# EAGLE design atkstepper17 (EAGLE 9.0.0)
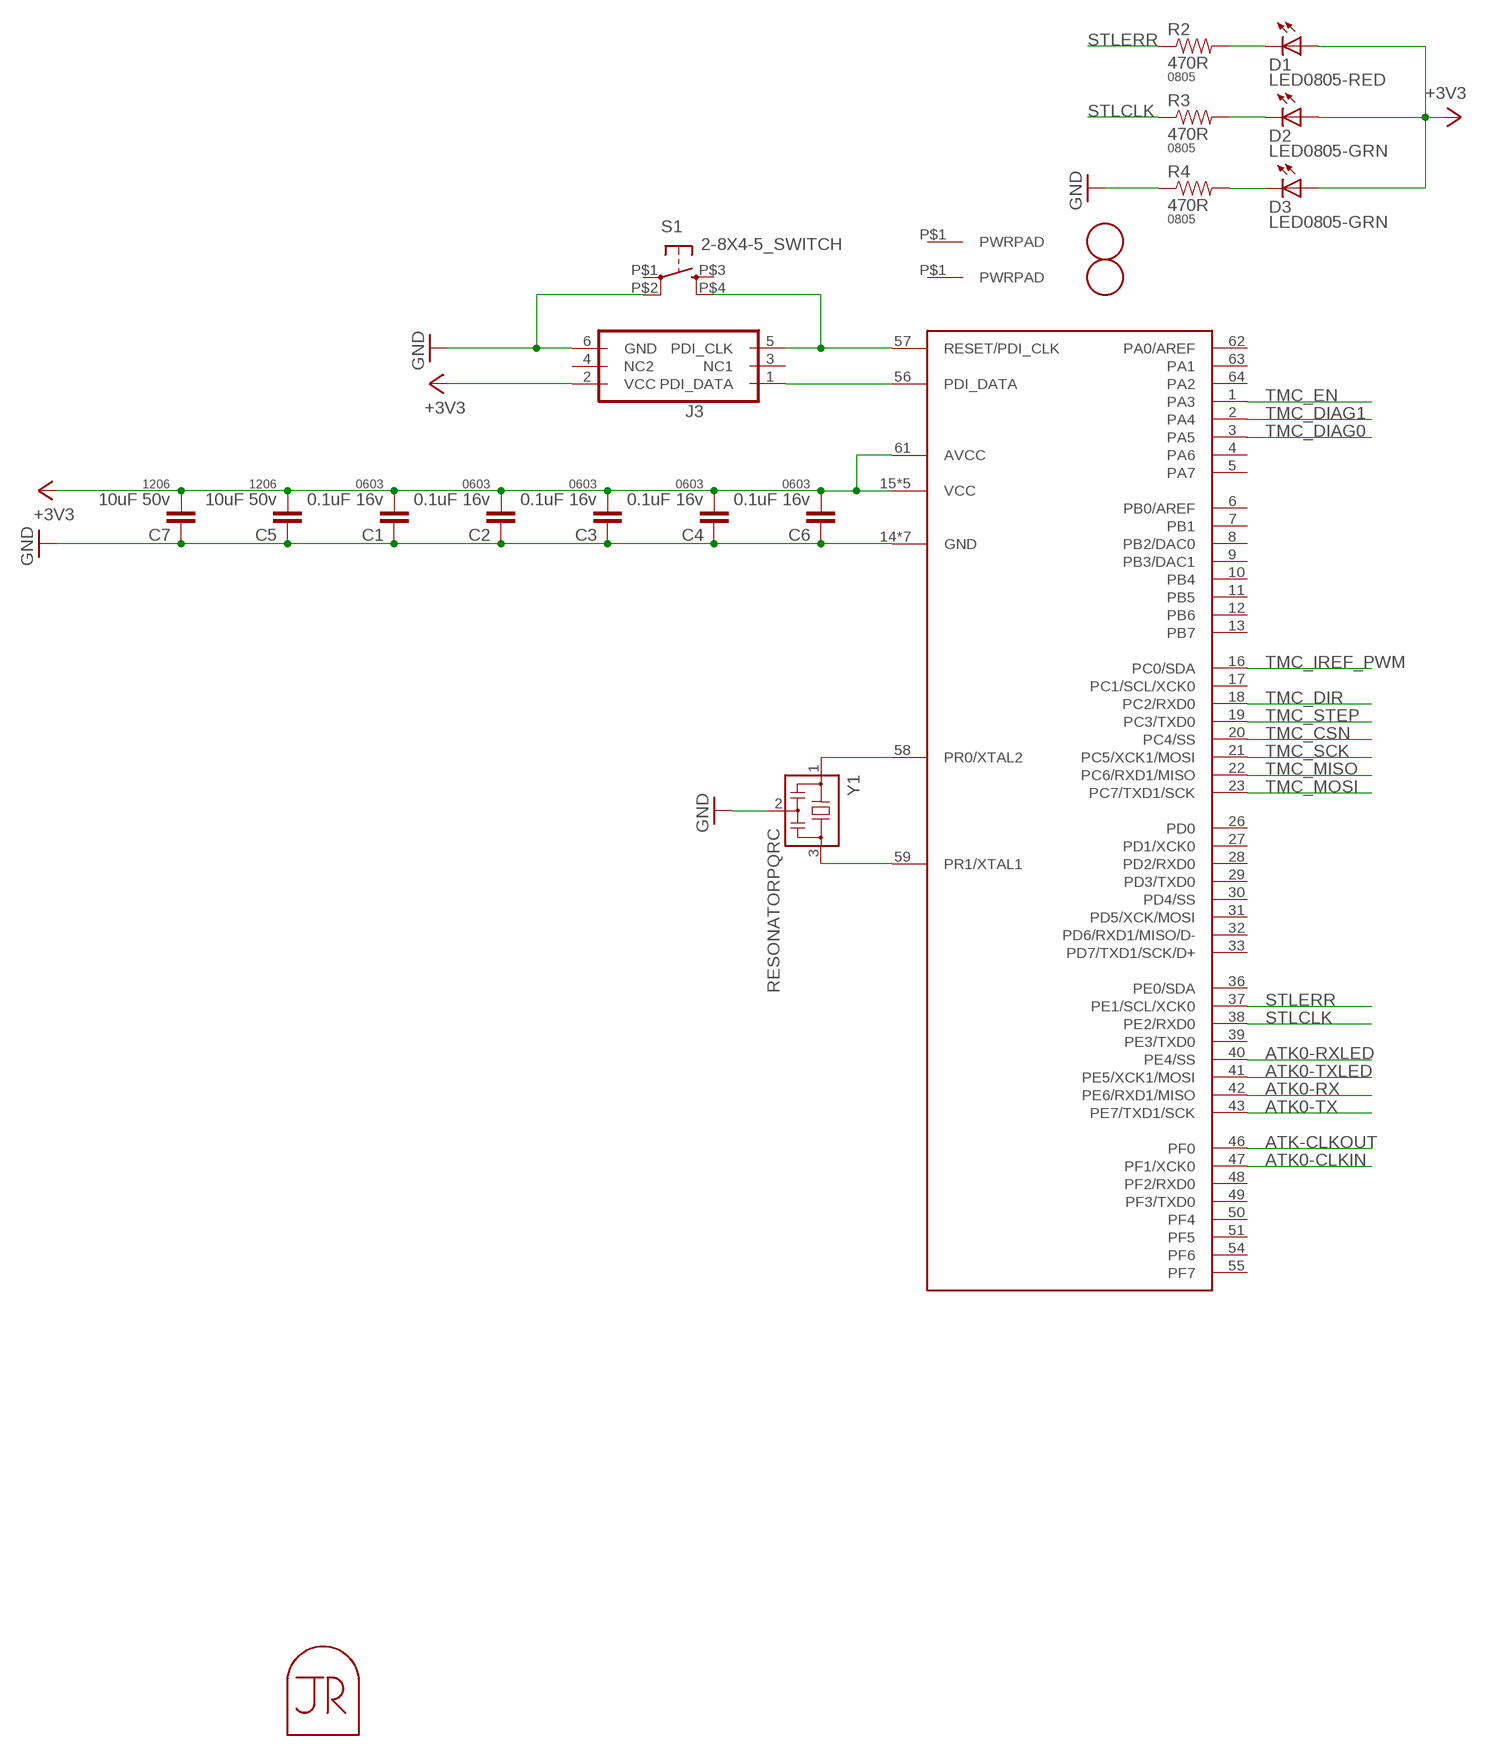
[diagram p0: schematic, sheet 1, part 1 of 2]
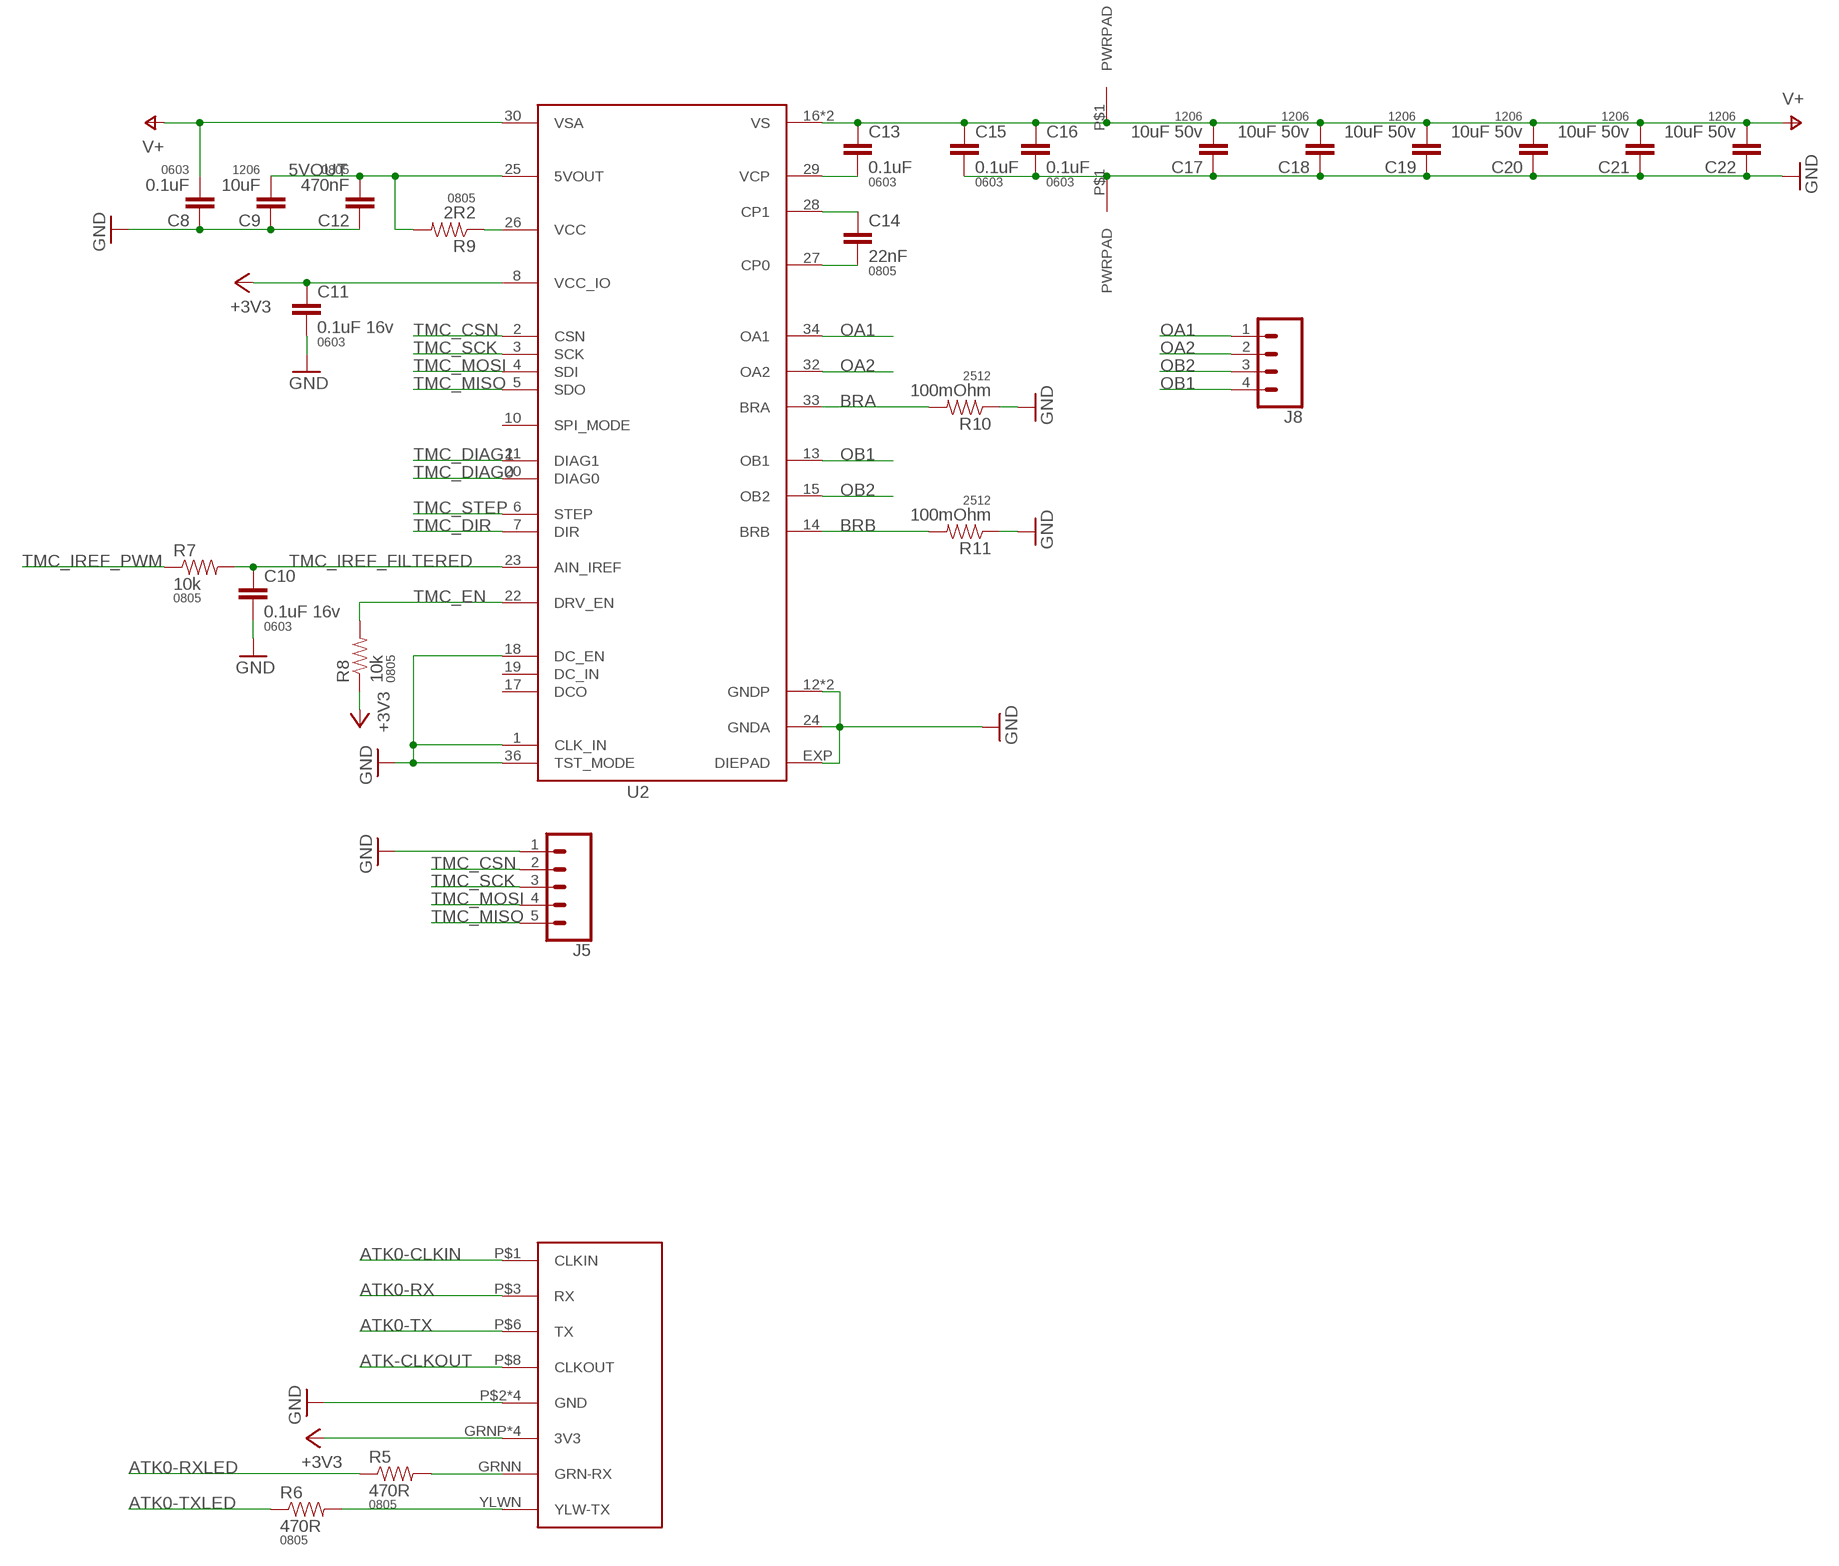
[diagram p1: schematic, sheet 1, part 2 of 2]

## Parts
C1  0.1uF 16v  CAP0603-CAP  [0603-CAP]
C2  0.1uF 16v  CAP0603-CAP  [0603-CAP]
C3  0.1uF 16v  CAP0603-CAP  [0603-CAP]
C4  0.1uF 16v  CAP0603-CAP  [0603-CAP]
C5  10uF 50v  CAP1206  [1206]
C6  0.1uF 16v  CAP0603-CAP  [0603-CAP]
C7  10uF 50v  CAP1206  [1206]
C8  0.1uF  CAP0603-CAP  [0603-CAP]
C9  10uF  CAP1206  [1206]
C10  0.1uF 16v  CAP0603-CAP  [0603-CAP]
C11  0.1uF 16v  CAP0603-CAP  [0603-CAP]
C12  470nF  CAP0805  [0805]
C13  0.1uF  CAP0603-CAP  [0603-CAP]
C14  22nF  CAP0805  [0805]
C15  0.1uF  CAP0603-CAP  [0603-CAP]
C16  0.1uF  CAP0603-CAP  [0603-CAP]
C17  10uF 50v  CAP1206  [1206]
C18  10uF 50v  CAP1206  [1206]
C19  10uF 50v  CAP1206  [1206]
C20  10uF 50v  CAP1206  [1206]
C21  10uF 50v  CAP1206  [1206]
C22  10uF 50v  CAP1206  [1206]
D1  LED0805-RED  LED0805  [LED0805]
D2  LED0805-GRN  LED0805  [LED0805]
D3  LED0805-GRN  LED0805  [LED0805]
J1  PWRPADM3  [PWRPAD_3-25MM]
J2  PWRPADM3  [PWRPAD_3-25MM]
J3  PDIFEMALE_SMD  [PDI_2X3_SMD]
J4  ATK-PHY  [RJ45-LED-RJE7318800XXX]
J5  CONN_05NO_SILK  [1X05_NO_SILK]
J6  PWRPAD  [PWRPAD_M3-PEM-MOUNT]
J7  PWRPAD  [PWRPAD_M3-PEM-MOUNT]
J8  CONN_04LONGPADS  [1X04_LONGPADS]
MP1  JRTOMBSTONE  [JRTOMBSTONE]
R2  470R  RESISTOR0805-RES  [0805]
R3  470R  RESISTOR0805-RES  [0805]
R4  470R  RESISTOR0805-RES  [0805]
R5  470R  RESISTOR0805-RES  [0805]
R6  470R  RESISTOR0805-RES  [0805]
R7  10k  RESISTOR0805-RES  [0805]
R8  10k  RESISTOR0805-RES  [0805]
R9  2R2  RESISTOR0805-RES  [0805]
R10  100mOhm  RESISTOR2512  [R2512]
R11  100mOhm  RESISTOR2512  [R2512]
S1  2-8X4-5_SWITCH  [TACT-SWITCH-KMR6]
U1  ATXMEGA_A3UQFN  [QFN-64-9X9MM]
U2  TMC2130  [QFN36-5X6]
U$1  FIDUCIAL  [FIDUCIAL_1MM]
U$2  FIDUCIAL  [FIDUCIAL_1MM]
Y1  RESONATORPQRC  [RES_PRQC]

## Nets
5VOUT: C9.2 C12.2 R9.2 U2.25(5VOUT)
+3V3: C1.2 C2.2 C3.2 C4.2 C5.2 C6.2 C7.2 C11.1 D1.1(A) D2.1(A) D3.1(A) J3.2(VCC) J4.GRNP(3V3) J4.P$4(3V3) J4.P$5(3V3) J4.YLWP(3V3) R8.1 U1.15(VCC) U1.25(VCC) U1.35(VCC) U1.45(VCC) U1.53(VCC) U1.61(AVCC) U2.8(VCC_IO)
ATK0-CLKIN: J4.P$1(CLKIN) U1.47(PF1/XCK0)
ATK0-RX: J4.P$3(RX) U1.42(PE6/RXD1/MISO)
ATK0-RXLED: R5.1 U1.40(PE4/SS)
ATK0-TX: J4.P$6(TX) U1.43(PE7/TXD1/SCK)
ATK0-TXLED: R6.1 U1.41(PE5/XCK1/MOSI)
ATK-CLKOUT: J4.P$8(CLKOUT) U1.46(PF0)
BRA: R10.2 U2.33(BRA)
BRB: R11.2 U2.14(BRB)
GND: C1.1 C2.1 C3.1 C4.1 C5.1 C6.1 C7.1 C8.1 C9.1 C10.2 C11.2 C12.1 C15.2 C16.2 C17.1 C18.1 C19.1 C20.1 C21.1 C22.1 J3.6(GND) J4.P$2(GND) J4.P$7(GND) J4.SHDL1(GND) J4.SHDL2(GND) J5.1 J7.P$1(PWRPAD) R4.1 R10.1 R11.1 S1.P$2(P1) U1.14(GND) U1.24(GND) U1.34(GND) U1.44(GND) U1.52(GND) U1.60(GND) U1.P$1(GND) U2.1(CLK_IN) U2.12(GNDP) U2.18(DC_EN) U2.24(GNDA) U2.35(GNDP) U2.36(TST_MODE) U2.EXP(DIEPAD) Y1.2
N$1: D3.2(C) R4.2
N$2: J3.5(PDI_CLK) S1.P$4(S1) U1.57(RESET/PDI_CLK)
N$3: U1.58(PR0/XTAL2) Y1.1
N$4: U1.59(PR1/XTAL1) Y1.3
N$5: D2.2(C) R3.2
N$6: D1.2(C) R2.2
N$8: J3.1(PDI_DATA) U1.56(PDI_DATA)
N$12: C14.2 U2.27(CP0)
N$13: R9.1 U2.26(VCC)
N$14: C14.1 U2.28(CP1)
N$15: C13.2 U2.29(VCP)
N$16: J4.GRNN(GRN-RX) R5.2
N$17: J4.YLWN(YLW-TX) R6.2
OA1: J8.1 U2.34(OA1)
OA2: J8.2 U2.32(OA2)
OB1: J8.4 U2.13(OB1)
OB2: J8.3 U2.15(OB2)
STLCLK: R3.1 U1.38(PE2/RXD0)
STLERR: R2.1 U1.37(PE1/SCL/XCK0)
TMC_CSN: J5.2 U1.20(PC4/SS) U2.2(CSN)
TMC_DIAG0: U1.3(PA5) U2.20(DIAG0)
TMC_DIAG1: U1.2(PA4) U2.21(DIAG1)
TMC_DIR: U1.18(PC2/RXD0) U2.7(DIR)
TMC_EN: R8.2 U1.1(PA3) U2.22(DRV_EN)
TMC_IREF_FILTERED: C10.1 R7.2 U2.23(AIN_IREF)
TMC_IREF_PWM: R7.1 U1.16(PC0/SDA)
TMC_MISO: J5.5 U1.22(PC6/RXD1/MISO) U2.5(SDO)
TMC_MOSI: J5.4 U1.23(PC7/TXD1/SCK) U2.4(SDI)
TMC_SCK: J5.3 U1.21(PC5/XCK1/MOSI) U2.3(SCK)
TMC_STEP: U1.19(PC3/TXD0) U2.6(STEP)
V+: C8.2 C13.1 C15.1 C16.1 C17.2 C18.2 C19.2 C20.2 C21.2 C22.2 J6.P$1(PWRPAD) U2.16(VS) U2.30(VSA) U2.31(VS)
Unconnected: J1.P$1(PWRPAD) J2.P$1(PWRPAD) J3.3(NC1) J3.4(NC2) S1.P$1(P) S1.P$3(S) U1.4(PA6) U1.5(PA7) U1.6(PB0/AREF) U1.7(PB1) U1.8(PB2/DAC0) U1.9(PB3/DAC1) U1.10(PB4) U1.11(PB5) U1.12(PB6) U1.13(PB7) U1.17(PC1/SCL/XCK0) U1.26(PD0) U1.27(PD1/XCK0) U1.28(PD2/RXD0) U1.29(PD3/TXD0) U1.30(PD4/SS) U1.31(PD5/XCK/MOSI) U1.32(PD6/RXD1/MISO/D-) U1.33(PD7/TXD1/SCK/D+) U1.36(PE0/SDA) U1.39(PE3/TXD0) U1.48(PF2/RXD0) U1.49(PF3/TXD0) U1.50(PF4) U1.51(PF5) U1.54(PF6) U1.55(PF7) U1.62(PA0/AREF) U1.63(PA1) U1.64(PA2) U2.10(SPI_MODE) U2.17(DCO) U2.19(DC_IN)

## Library data of the parts
C1-C4 C6 C8 C10 C11 C13 C15 C16 = borkedlabs-passives:CAP: Capacitor Standard 0603 ceramic capacitor, and 0.1" leaded capacitor.; PACKAGE: 0603
C5 C7 C9 C17-C22 = borkedlabs-passives:CAP: Capacitor Standard 0603 ceramic capacitor, and 0.1" leaded capacitor.; PACKAGE: 1206
C12 C14 = borkedlabs-passives:CAP: Capacitor Standard 0603 ceramic capacitor, and 0.1" leaded capacitor.; PACKAGE: 0805
D1-D3 = lights:LED: LED
J1 J2 J6 J7 = power:PWRPAD
J3 = microcontrollers:PDI: Multi connection point. Often used as Generic Header-pin footprint for 0.1 inch spaced/style header connections You can populate with any combo of single row headers, but if you'd like an exact match, check these: Header - 2x3 (Male, 0.1") <https://www.sparkfun.com/products/12807> (PRT-12807) Header - 2x3 (Female, 0.1") <https://www.sparkfun.com/products/13010> (PRT-13010) 2x3 Pin Shrouded Header <https://www.sparkfun.com/products/10877> (PRT-10877) On any of the 0.1 inch spaced packages, you can populate with these: Break Away Headers - Straight <https://www.sparkfun.com/products/116> (PRT-00116) Break Away Male Headers - Right Angle <https://www.sparkfun.com/products/553> (PRT-00553) Female Headers <https://www.sparkfun.com/products/115> (PRT-00115) Break Away Headers - Machine Pin <https://www.sparkfun.com/products/117> (PRT-00117) Break Away Female Headers - Swiss Machine Pin <https://www.sparkfun.com/products/743> (PRT-00743) Special note: the shrouded connector mates well with our 3x2 ribbon cables: Ribbon Crimp Connector - 6-pin (2x3, Female) <https://www.sparkfun.com/products/10651> (PRT-10651) Ribbon Cable - 6 wire (15ft) <https://www.sparkfun.com/products/10646> (PRT-10646); PROD_ID: CONN-11290
J4 = connector:ATK-PHY
J5 = SparkFun-Connectors:CONN_05: Multi connection point. Often used as Generic Header-pin footprint for 0.1 inch spaced/style header connections On any of the 0.1 inch spaced packages, you can populate with these: Break Away Headers - Straight <https://www.sparkfun.com/products/116> (PRT-00116) Break Away Male Headers - Right Angle <https://www.sparkfun.com/products/553> (PRT-00553) Female Headers <https://www.sparkfun.com/products/115> (PRT-00115) Break Away Headers - Machine Pin <https://www.sparkfun.com/products/117> (PRT-00117) Break Away Female Headers - Swiss Machine Pin <https://www.sparkfun.com/products/743> (PRT-00743) For SCREWTERMINALS and SPRING TERMINALS visit here: Screw Terimnals on SparkFun.com <https://www.sparkfun.com/search/results?term=Screw+Terminals> (5mm/3.5mm/2.54mm spacing) This device is also useful as a general connection point to wire up your design to another part of your project. Our various solder wires solder well into these plated through hole pads. Hook-Up Wire - Assortment (Stranded, 22 AWG) <https://www.sparkfun.com/products/11375> (PRT-11375) Hook-Up Wire - Assortment (Solid Core, 22 AWG) <https://www.sparkfun.com/products/11367> (PRT-11367) View the entire wire category on our website here <https://www.sparkfun.com/categories/141> Special notes: Molex polarized connector foot print use with SKU : PRT-08231 with associated crimp pins and housings. 1MM SMD Version SKU: PRT-10208
J8 = SparkFun-Connectors:CONN_04: Multi connection point. Often used as Generic Header-pin footprint for 0.1 inch spaced/style header connections On any of the 0.1 inch spaced packages, you can populate with these: Break Away Headers - Straight <https://www.sparkfun.com/products/116> (PRT-00116) Break Away Male Headers - Right Angle <https://www.sparkfun.com/products/553> (PRT-00553) Female Headers <https://www.sparkfun.com/products/115> (PRT-00115) Break Away Headers - Machine Pin <https://www.sparkfun.com/products/117> (PRT-00117) Break Away Female Headers - Swiss Machine Pin <https://www.sparkfun.com/products/743> (PRT-00743) For SCREWTERMINALS and SPRING TERMINALS visit here: Screw Terimnals on SparkFun.com <https://www.sparkfun.com/search/results?term=Screw+Terminals> (5mm/3.5mm/2.54mm spacing) This device is also useful as a general connection point to wire up your design to another part of your project. Our various solder wires solder well into these plated through hole pads. Hook-Up Wire - Assortment (Stranded, 22 AWG) <https://www.sparkfun.com/products/11375> (PRT-11375) Hook-Up Wire - Assortment (Solid Core, 22 AWG) <https://www.sparkfun.com/products/11367> (PRT-11367) View the entire wire category on our website here <https://www.sparkfun.com/categories/141> Special notes: Molex polarized connector foot print use with SKU : PRT-08231 with associated crimp pins and housings. 1MM SMD Version SKU: PRT-10208; PROD_ID: CONN-09696
MP1 = connector:JRTOMBSTONE
R2-R9 = borkedlabs-passives:RESISTOR: Resistor Basic schematic elements and footprints for 0603, 1206, and PTH resistors.; PACKAGE: 0805
R10 R11 = borkedlabs-passives:RESISTOR: Resistor Basic schematic elements and footprints for 0603, 1206, and PTH resistors.; PACKAGE: 2512
S1 = fab:2-8X4-5_SWITCH
U1 = microcontrollers:ATXMEGA_A3U
U2 = power:TMC2130
U$1 U$2 = connector:FIDUCIAL: For use by pick and place machines to calibrate the vision/machine, 1mm By microbuilder.eu
Y1 = passives:RESONATOR

## Board
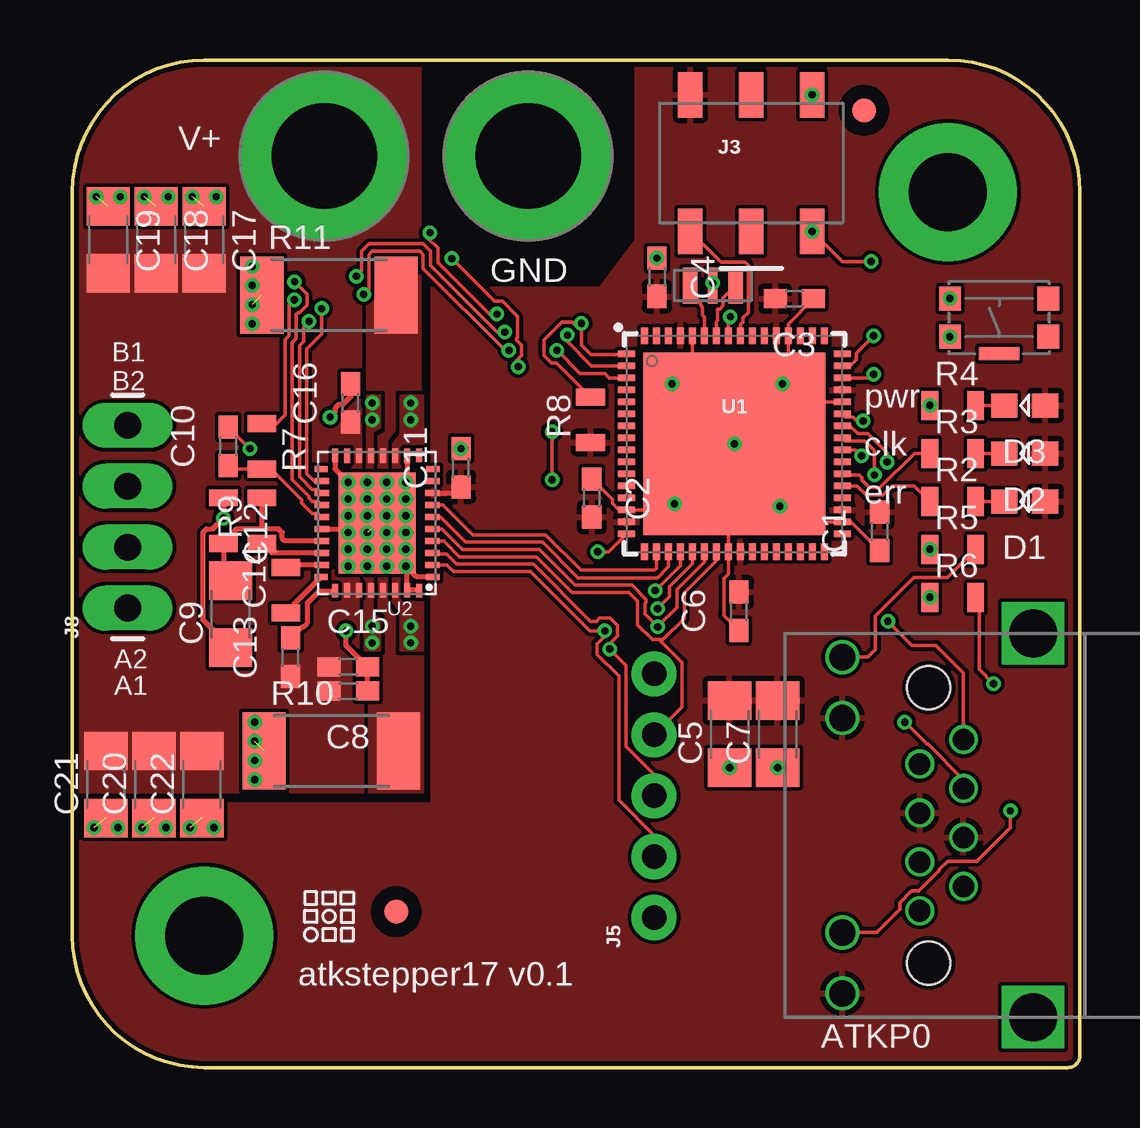
[diagram p2: board, top side]
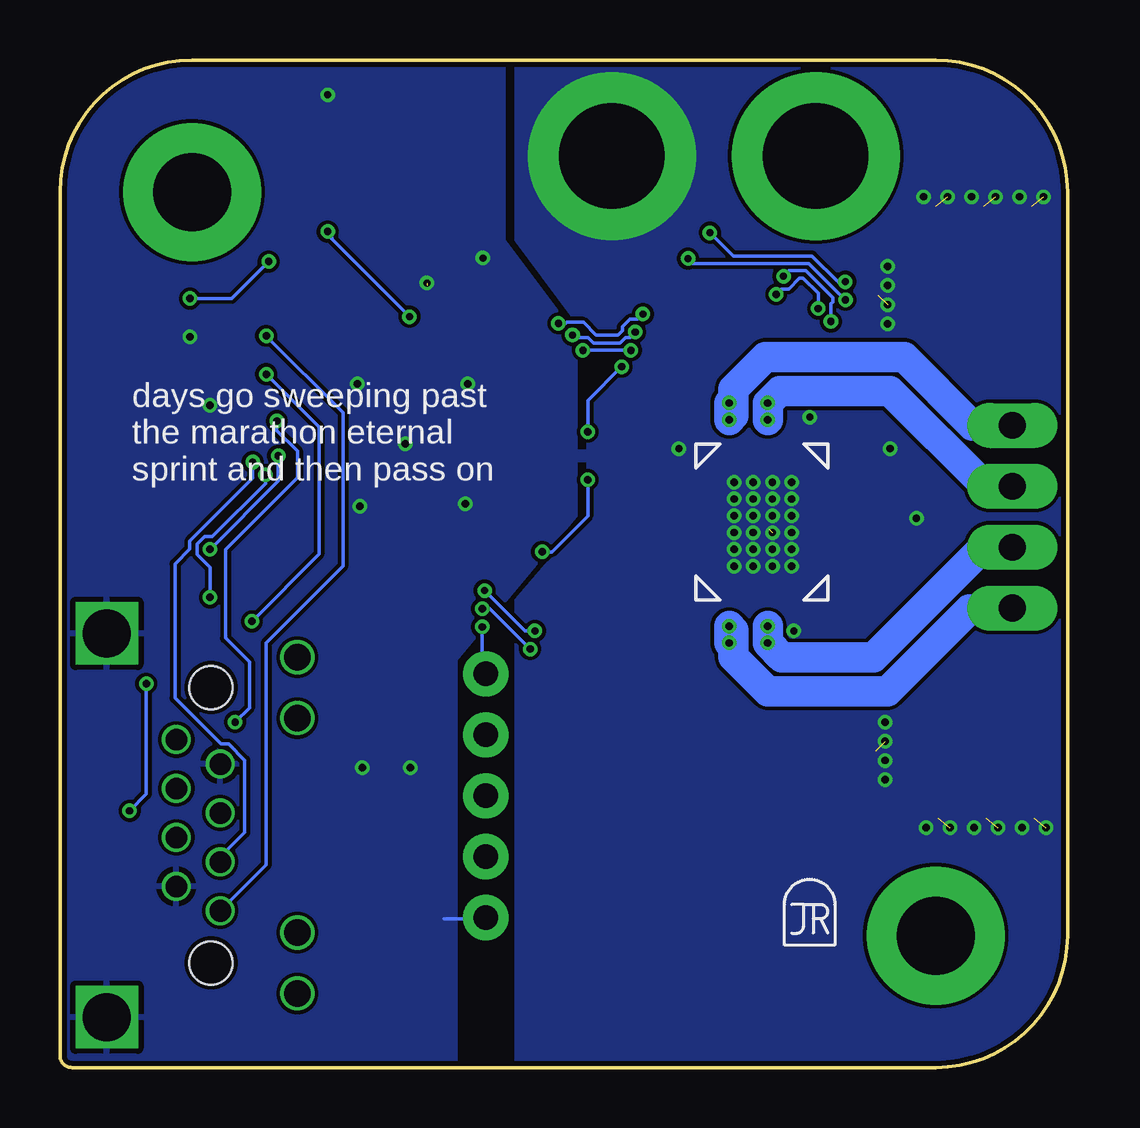
[diagram p3: board, bottom side, seen from below]

Size 42 x 42 mm. Coordinates in mm from the lower left corner, seen from the top.
Outline: 36.5,42 5.5,42 arc90 0,36.5 0,5.5 arc90 5.5,0 41.5,0 arc90 42,0.5 42,36.5 arc90 36.5,42
Copper layers (1*16): Top 0.035mm / dielectric 1.5mm / Bottom 0.035mm
Design rules "default *": minimum track width 6mil, minimum drill 0.3mm, track to track 6mil, track to pad 6mil, pad to pad 6mil, via to via 6mil, smd to smd 6mil, copper to edge 8mil, drill to drill 8mil, minimum pad ring 6mil, minimum via ring 6mil, stop-mask expansion 4mil, vias tented up to drill 27mil, thermal gap 9mil

### Footprints (pad centres in the part's own frame; a part is rotated, then mirrored left to right if it is on the bottom)
0603-CAP = smd 0.96 x 0.8: 1 -0.8,0; 2 0.8,0
1206 = smd 1.6 x 1.8: 1 -1.4,0; 2 1.4,0
0805 = smd 0.7 x 1.2: 1 -0.95,0; 2 0.95,0
LED0805 = smd 1.1 x 1: 1 -0.85,0; 2 0.85,0
PWRPAD_3-25MM = drill 3.25 pad 5.75: P$1 0,0
PDI_2X3_SMD = smd 1.02 x 1.9: 1 -2.54,-2.85; 2 -2.54,2.85; 3 0,-2.85; 4 0,2.85; 5 2.54,-2.85; 6 2.54,2.85
RJ45-LED-RJE7318800XXX = drill 1.1: GRNN 7.01,3.6; GRNP 4.47,3.6; YLWN -4.47,3.6; YLWP -7.01,3.6 | drill 0.9: P$1 -3.57,0.38; P$2 -2.55,-1.45; P$3 -1.53,0.38; P$4 -0.51,-1.45; P$5 0.51,0.38; P$6 1.53,-1.45; P$7 2.55,0.38; P$8 3.57,-1.45 | drill 2 square: SHDL1 -8,-4.35; SHDL2 8,-4.35 | hole 1.8: -5.74,0; 5.74,0
1X05_NO_SILK = drill 1.016 pad 1.88: 1 0,0; 2 2.54,0; 3 5.08,0; 4 7.62,0; 5 10.16,0
PWRPAD_M3-PEM-MOUNT = drill 4.4 pad 7: P$1 0,0
1X04_LONGPADS = drill 1.118 pad 1.88 long: 1 0,0; 2 2.54,0; 3 5.08,0; 4 7.62,0
R2512 = smd 1.8 x 3.2: 1 -2.8,0; 2 2.8,0
TACT-SWITCH-KMR6 = smd 0.9 x 1: P$1 -2.05,0.8; P$2 2.05,0.8; P$3 -2.05,-0.8; P$4 2.05,-0.8 | smd 1.7 x 0.55: P$5 0,1.5
QFN-64-9X9MM = smd 0.7 x 0.275: 1 -4.5,3.75; 2 -4.5,3.25; 3 -4.5,2.75; 4 -4.5,2.25; 5 -4.5,1.75; 6 -4.5,1.25; 7 -4.5,0.75; 8 -4.5,0.25; 9 -4.5,-0.25; 10 -4.5,-0.75; 11 -4.5,-1.25; 12 -4.5,-1.75; 13 -4.5,-2.25; 14 -4.5,-2.75; 15 -4.5,-3.25; 16 -4.5,-3.75; 33 4.5,-3.75; 34 4.5,-3.25; 35 4.5,-2.75; 36 4.5,-2.25; 37 4.5,-1.75; 38 4.5,-1.25; 39 4.5,-0.75; 40 4.5,-0.25; 41 4.5,0.25; 42 4.5,0.75; 43 4.5,1.25; 44 4.5,1.75; 45 4.5,2.25; 46 4.5,2.75; 47 4.5,3.25; 48 4.5,3.75 | smd 0.275 x 0.7: 17 -3.75,-4.5; 18 -3.25,-4.5; 19 -2.75,-4.5; 20 -2.25,-4.5; 21 -1.75,-4.5; 22 -1.25,-4.5; 23 -0.75,-4.5; 24 -0.25,-4.5; 25 0.25,-4.5; 26 0.75,-4.5; 27 1.25,-4.5; 28 1.75,-4.5; 29 2.25,-4.5; 30 2.75,-4.5; 31 3.25,-4.5; 32 3.75,-4.5; 49 3.75,4.5; 50 3.25,4.5; 51 2.75,4.5; 52 2.25,4.5; 53 1.75,4.5; 54 1.25,4.5; 55 0.75,4.5; 56 0.25,4.5; 57 -0.25,4.5; 58 -0.75,4.5; 59 -1.25,4.5; 60 -1.75,4.5; 61 -2.25,4.5; 62 -2.75,4.5; 63 -3.25,4.5; 64 -3.75,4.5 | smd 7.6 x 7.6: P$1 0,0
QFN36-5X6 = smd 0.55 x 0.25: 1 -2.325,1.75; 10 -2.325,-2.75; 19 2.325,-2.75; 28 2.325,1.75 | smd 0.6 x 0.25: 2 -2.3,1.25; 3 -2.3,0.75; 4 -2.3,0.25; 5 -2.3,-0.25; 6 -2.3,-0.75; 7 -2.3,-1.25; 8 -2.3,-1.75; 9 -2.3,-2.25; 20 2.3,-2.25; 21 2.3,-1.75; 22 2.3,-1.25; 23 2.3,-0.75; 24 2.3,-0.25; 25 2.3,0.25; 26 2.3,0.75; 27 2.3,1.25 | smd 0.25 x 0.55: 11 -1.75,-3.325; 18 1.75,-3.325; 29 1.75,2.325; 36 -1.75,2.325 | smd 0.25 x 0.6: 12 -1.25,-3.3; 13 -0.75,-3.3; 14 -0.25,-3.3; 15 0.25,-3.3; 16 0.75,-3.3; 17 1.25,-3.3; 30 1.25,2.3; 31 0.75,2.3; 32 0.25,2.3; 33 -0.25,2.3; 34 -0.75,2.3; 35 -1.25,2.3 | smd 3.2 x 4.2: EXP 0,-0.5
FIDUCIAL_1MM = smd 1 x 1: 1 0,0
RES_PRQC = smd 0.6 x 1.5: 1 -0.95,0; 3 0.95,0 | smd 0.4 x 1.5: 2 0,0

### Placement (x,y rotation side)
C1  33.65,22.35 90 top
C2  21.65,23.74 270 top
C3  30.1,32.05 180 top
C4  24.37,32.95 270 top
C5  27.4,13.9 90 top
C6  27.79,19.02 90 top
C7  29.4,13.9 90 top
C8  11.5,15.7 180 top
C9  6.6,18.9 90 top
C10  6.5,25.9 90 top
C11  16.2,25 90 top
C12  6.3,22.8 270 top
C13  9.1,17.1 90 top
C14  8.9,19.9 90 top
C15  11.5,16.7 0 top
C16  11.6,27.7 90 top
C17  5.5,34.5 270 top
C18  3.5,34.5 270 top
C19  1.5,34.5 270 top
C20  3.4,11.8 90 top
C21  1.4,11.8 90 top
C22  5.4,11.8 90 top
D1  39.7,23.6 180 top
D2  39.7,25.6 180 top
D3  39.7,27.6 180 top
J1  5.5,5.5 180 top
J2  36.5,36.5 180 top
J3  28.3,37.7 0 top
J4  35.7,10.1 90 top
J5  24.25,6.25 90 top
J6  10.5,38 180 top
J7  19,38 180 top
J8  2.3,19.15 90 top
MP1  10.7,6.1 0 bottom
R2  36.7,23.6 0 top
R3  36.7,25.6 0 top
R4  36.7,27.6 0 top
R5  36.7,21.6 0 top
R6  36.7,19.6 0 top
R7  7.9,25.9 270 top
R8  21.6,27 90 top
R9  7.9,22.8 90 top
R10  10.8,13.2 0 top
R11  10.7,32.2 0 top
S1  38.63,31.26 180 top
U1  27.6,26 0 top
U2  12.7,22.2 180 top
U$1  13.5,6.5 0 top
U$2  33,39.9 0 top
U$5  [CBA-SILK-LOGO]  10.7,6.3 90 top
Y1  26.7,32.6 180 top

### Tracks (layer width: path | path; a pad name or v marks a point on that pad's centre or on a via)
5VOUT
  Top 0.203: C12.2 6.2,21.65 | C12.2 6.3,21.9 6.85,22.45 7.9,22.45 | C12.2 6.3,20.6 C9.2 | U2.25 8.85,21.95 8.75,22.05 8.75,22.3 8.61,22.45 7.9,22.45 | R9.2 7.9,22.45
+3V3
  Top 0.203: U2.8 15.95,23.95 C11.1
  pour Top: -3,11 15,11 15,32.5 22,32.5 23.5,34.5 23.5,43 43,43 43,-2 -3,-2
ATK0-CLKIN  (via drill 0.3)
  Top 0.152: v33.4,30.5 32.68,29.78 32.68,29.52 32.41,29.25 U1.47
  Bottom 0.152: v33.4,30.5 30.2,27.3 30.2,20.9 33.4,17.7 33.4,8.45 J4.P$1
ATK0-RX  (via drill 0.3)
  Top 0.152: U1.42 32.41,26.75 32.74,26.42 33.17,26.42 33.97,25.62 v33.97,25.24
  Bottom 0.152: v33.97,25.24 33.97,24.57 36.59,21.95 36.59,21.61 37.2,21 37.2,15.4 35.28,13.48 34.98,13.48 34.3,12.8 34.3,9.8 35.32,8.78 J4.P$3
ATK0-RXLED  (via drill 0.3)
  Top 0.152: U1.40 32.66,25.75 v32.91,25.5
  Bottom 0.152: v32.91,25.5 32.91,24.45 R5.1
  other vias: 35.75,21.6
ATK0-TX  (via drill 0.3)
  Top 0.152: U1.43 32.23,27.12 32.55,27.12 32.71,26.95 v32.96,26.95 | v34.7,14.4 35.62,13.48 35.66,13.48 37.15,11.99 J4.P$6
  Bottom 0.152: v32.96,26.95 32.96,26.56 32.1,25.7 32.1,24.6 35.1,21.6 35.1,17.9 34.1,16.9 34.1,15 v34.7,14.4
ATK0-TXLED  (via drill 0.3)
  Top 0.152: U1.41 32.23,26.12 33.04,26.12 33.44,25.72 v33.44,24.7
  Bottom 0.152: v33.44,24.7 33.44,24.34 35.65,22.13 35.97,22.13 36.28,21.82 36.28,21.38 35.75,20.85 R6.1
  other vias: 35.75,19.6
ATK-CLKOUT  (via drill 0.3)
  Top 0.152: U1.46 33.25,28.75 v33.4,28.9 | v34,18.6 35,17.6 36,17.6 37.15,16.45 J4.P$8
  Bottom 0.152: v33.4,28.9 31.2,26.7 31.2,21.4 v34,18.6
BRA
  pour Top (rank 4, no thermals): 14.6,20.6 14.6,11.5 12.4,11.5 12.4,20.6
BRB
  pour Top (rank 4, no thermals): 14.5,33 14.5,23.9 12.3,23.9 12.3,33
GND  (via drill 0.3)  (10 unrouted)
  Top 0.152: 13.95,20.95 v13.9,20.9 | 13.95,23.95 U2.EXP | R4.1 35.85,27.7 | C10.2 v7.4,25.8 | U1.60 25.85,29.35 25.8,29.3 25.8,27.8 27.55,26.05 | 27.55,26.05 U1.P$1 27.45,25.85 | 29.45,27.95 29.85,28.35 U1.52 29.85,31 C3.1 | 29.45,27.95 27.55,26.05 | 27.35,25.75 v25.1,23.5 24.85,23.25 U1.14 22.79,23.25 22.52,23.52 22.52,23.67 C2.1 | 27.35,25.75 U1.24 27.35,20.58 27.16,20.39 27.16,18.85 C6.1 | 27.35,25.75 27.45,25.85 | 27.45,25.85 30.55,22.75 U1.34 32.45,22.75 C1.1 | U1.44 29.65,27.75 29.45,27.95
  Top 0.203: U2.24 12.45,22.45 U2.EXP | C9.1 5.45,18.65 5.45,22.3 5.59,22.45 5.85,22.45 v6.3,22.9 C12.1 | U2.12 13.95,24.45 v13.9,24.4 | 13.95,20.85 U2.35 14.43,19.9 U2.36 | 13.95,20.85 v13.9,20.9 | U2.1 14.35,20.45 13.95,20.85 | U2.18 10.95,24.95 v11.5,24.4 | C16.2 11.6,27.96 11.27,27.63 11.1,27.63 10.95,27.48 10.95,27.31 v10.74,27.11 | C8.1 C15.2 11.41,17.59 v11.41,18.2
  Bottom 0.152: J5.1 24.3,6.2 26,6.2
  other vias: 11.5,21.6 12.3,21.6 13.1,21.6 13.9,21.6 13.1,23.7 13.1,23 13.9,23.7 13.9,23 12.3,23 12.3,23.7 11.5,23.7 11.5,23 13.9,22.3 13.1,22.3 12.3,22.3 11.5,22.3 13.1,24.4 12.3,24.4 11.5,20.9 12.3,20.9 13.1,20.9 7.6,12 7.6,12.8 7.6,14.4 7.6,13.6 5.9,10 4.9,10 3.9,10 2.9,10 1.9,10 0.9,10 6,36.3 5,36.3 4,36.3 3,36.3 2,36.3 1,36.3 7.5,33.4 7.5,31 7.5,32.6 7.5,31.8 35.75,27.6 36.58,30.46 24.37,33.75 26.7,32.7 27.6,26 29.5,23.4 25,28.5 29.6,28.5 30.84,40.55 29.4,12.5 27.4,12.5 16.2,25.8
  pour Bottom: -2.5,-1.5 23,-1.5 23,19.5 20,23 20,25.3 20.5,25.3 20.5,25.7 20,25.7 20.1,30.6 23,34.5 23,44.5 -2.5,44.5
  pour Bottom: 25.5,-2.5 25.5,17 20.5,23 20.5,30.5 23.5,34.5 23.5,43 43.5,43 43.5,-2.5
N$1
  Top 0.152: D3.2 R4.2
N$2  (via drill 0.3)
  Top 0.152: 27.4,30.55 U1.57 27.35,31.22 v27.43,31.3 | J3.5 32.09,33.6 v33.3,33.6
  Bottom 0.152: 30.65,34.55 30.81,34.8 | 30.81,34.8 J3.5 | v27.43,31.3 30.81,34.67 30.81,34.8 | v33.3,33.6 34.84,32.06 S1.P$4
  other vias: 30.84,34.85 36.58,32.06
N$3
  Top 0.152: U1.58 26.85,31.08 26.9,31.13 26.9,31.6 26.92,31.62 27,31.62 27.13,31.75 27.13,32.08 Y1.1
N$4
  Top 0.152: Y1.3 26.27,31.68 26.27,31.36 26.35,31.28 U1.59
N$5
  Top 0.152: D2.2 R3.2
N$6
  Top 0.152: D1.2 R2.2
N$8
  Top 0.152: J3.1 27.03,33.58 28.05,33.58 28.18,33.45 28.18,31.48 27.96,31.26 27.96,31.08 27.85,30.97 U1.56
N$12
  Top 0.203: U2.27 9.3,20.95 C14.2
N$13
  Top 0.203: R9.1 8.3,21.45 8.49,21.45 9.9,21.45 9.91,21.45 U2.26
N$14
  Top 0.203: U2.28 9.2,19.27 C14.1
N$15
  Top 0.203: C13.2 9.55,18.35 9.61,18.35 9.8,18.54 9.8,19.37 10.3,19.88 U2.29
N$16
  Top 0.152: J4.GRNN 33.16,17.11 33.47,17.42 33.47,18.82 35.08,20.43 36.48,20.43 R5.2
N$17  (via drill 0.3)
  Top 0.152: R6.2 37.8,19.45 37.8,16.6 v38.4,16 | v39.1,10.7 39.1,10 37.7,8.6 36.5,8.6 36.15,8.25 36.15,8.23 35.29,7.36 34.98,7.36 34.49,6.87 34.49,6.59 33.53,5.63 J4.YLWN
  Bottom 0.152: v38.4,16 38.4,11.4 v39.1,10.7
OA1  (via drill 0.3)
  Bottom 1.27: 13.92,17.52 v14.1,17.7 v14.1,18.4 13.92,18.22 13.92,17.11 12.49,15.68 7.51,15.68 4.09,19.1 2.35,19.1 J8.1
  pour Top (no thermals): 13.7,20.6 13.7,19.4 14.6,19.4 14.6,17.4 13.7,17.4 13.7,19 13.4,19.4 13.4,20.6
OA2  (via drill 0.3)
  Bottom 1.27: J8.2 2.51,21.7 3.5,21.7 8.1,17.1 11.9,17.1 v12.5,17.7 v12.5,18.4
  pour Top (no thermals): 12.5,20.6 12.5,18.9 12.8,18.7 12.8,17.4 12.2,17.4 12.2,20.6
OB1  (via drill 0.3)
  Bottom 1.27: v14.1,27.7 v14.1,27 13.92,27.18 13.92,28.29 12.59,29.62 6.81,29.62 3.96,26.77 J8.4
  pour Top (no thermals): 13.7,24.8 13.7,26 14.6,26 14.6,28 13.7,28 13.7,26.4 13.4,26 13.4,24.8
OB2  (via drill 0.3)
  Bottom 1.27: v12.5,27 v12.5,27.7 12,28.2 9.1,28.2 7.4,28.2 3.43,24.23 J8.3
  pour Top (no thermals): 12.5,24.8 12.5,26.5 12.8,26.7 12.8,28 12.3,28 12.3,24.8
STLCLK
  Top 0.152: U1.38 32.15,24.7 32.8,24.7 32.91,24.59 32.91,24.48 33.22,24.17 33.67,24.17 35.1,25.6 R3.1
STLERR
  Top 0.152: R2.1 35.1,24.25 34.18,24.25 33.8,23.86 33.09,23.86 32.7,24.25 U1.37
TMC_CSN  (via drill 0.3)
  Top 0.152: U2.2 15.63,20.95 15.89,20.68 19.09,20.68 21.58,18.2 v22.2,18.2 22.2,17.99 21.87,17.66 21.87,17.22 22.78,16.32 22.78,11.15 24.25,9.68 J5.2 | U1.20 25.35,20.93 v24.3,19.89
  Bottom 0.152: v24.3,19.89 22.61,18.2 v22.2,18.2
TMC_DIAG0  (via drill 0.3)
  Top 0.152: U2.20 10.08,24.45 9.78,24.75 9.78,29.96 10.39,30.58 v10.39,31.64 | v18.2,29.9 18.03,29.9 14.63,33.3 14.63,33.9 14.49,34.03 12.51,34.03 12.37,33.9 12.37,32.46 v12.14,32.23 | v20.2,29.9 21.17,28.93 22.2,28.93 22.37,28.75 U1.3
  Bottom 0.152: v18.2,29.9 v20.2,29.9 | v10.39,31.64 10.39,32.28 11.03,32.91 11.17,32.91 11.62,32.46 11.92,32.46 v12.14,32.23
TMC_DIAG1  (via drill 0.3)
  Top 0.152: U2.21 10.25,24.1 10,24.1 9.47,24.63 9.47,30.08 9.64,30.25 9.64,30.87 v9.86,31.1 | v18.02,30.66 17.7,30.66 14.93,33.43 14.93,34.02 14.62,34.33 12.38,34.33 12.07,34.02 12.07,33.21 v11.84,32.99 | U1.2 21.65,29.25 20.64,30.27 v20.64,30.54
  Bottom 0.152: v18.02,30.66 18.25,30.43 18.42,30.43 18.65,30.2 19.75,30.2 19.98,30.43 20.53,30.43 v20.64,30.54 | v9.86,31.1 9.86,31.84 9.79,31.91 9.79,32.1 10.9,33.21 11.61,33.21 v11.84,32.99
TMC_DIR
  Top 0.152: U2.7 15.45,23.45 16.7,22.2 19.73,22.2 21.2,20.73 24.27,20.73 24.35,20.81 U1.18
TMC_EN  (via drill 0.3)
  Top 0.152: U2.22 10.25,23.6 10.01,23.6 9.87,23.73 9.87,23.8 9.16,24.5 9.16,30.21 9.33,30.38 9.33,31.4 9.4,31.47 9.47,31.47 9.79,31.78 9.79,32.23 v9.26,32.76 | 14.75,34.64 14.79,34.59 | 14.79,34.59 15.24,34.15 15.24,33.55 17.38,31.41 v17.7,31.41 | v21.22,31.02 21.22,31 | 21.22,31 21.22,30.11 21.62,29.72 23.07,29.72 U1.1 | 21.22,31 20.92,31 20.86,31.07 20.41,31.07 19.67,30.32 19.67,29.68 19.98,29.37 20.18,29.37 R8.2 | v14.91,34.8 14.79,34.68 14.79,34.59
  Bottom 0.152: v17.7,31.41 17.92,31.19 18.24,31.19 18.55,30.88 18.55,30.73 18.74,30.54 19.66,30.54 20.18,31.07 20.86,31.07 20.9,31.02 v21.22,31.02 | v9.26,32.76 9.58,32.76 10.65,33.82 13.93,33.82 v14.91,34.8
TMC_IREF_FILTERED
  Top 0.152: U2.23 10.25,23.1 10.01,23.1 9.57,23.54 9.57,23.67 8.29,24.95 R7.2 | R7.2 7.75,25.1 | C10.1 6.65,24.95 R7.2
TMC_IREF_PWM  (via drill 0.3)
  Top 0.152: R7.1 8.51,26.85 8.86,27.2 8.86,30.34 9.03,30.5 9.03,31.77 v9.26,32 | v15.82,33.72 17.6,31.94 17.92,31.94 18.55,31.31 18.55,30.44 18.52,30.41 18.52,30.32 18.73,30.12 18.73,29.68 18.52,29.48 18.52,29.27 v18.59,29.21 | v21.9,21.5 22.35,21.5 U1.16 | v20,26.5 v20,24.5
  Bottom 0.152: v18.59,29.21 20,27.8 v20,26.5 | v21.9,21.5 21.5,21.5 20,23 v20,24.5 | v15.82,33.72 15.62,33.52 10.77,33.52 v9.26,32
TMC_MISO  (via drill 0.3)
  Top 0.152: U2.5 15.42,22.45 16.27,21.59 19.47,21.59 20.96,20.11 23.32,20.11 23.92,19.52 23.92,19.39 23.87,19.35 23.87,18.91 v24.4,18.38 | v24.4,18.38 v24.4,18.37 | v24.4,18.38 25.2,19.18 25.2,19.93 26.35,21.07 U1.22
  Bottom 0.152: v24.4,18.37 24.4,16.56 J5.5
TMC_MOSI
  Top 0.152: U2.4 15.49,21.95 16.15,21.29 19.35,21.29 20.83,19.81 23.2,19.81 23.56,19.44 23.56,18.45 24.18,17.84 24.5,17.84 | 24.5,17.84 24.62,17.84 25.51,18.73 25.51,19.8 26.85,21.14 U1.23 | 24.5,17.84 24.5,17.81 25.42,16.89 25.42,15.04 J5.4
TMC_SCK  (via drill 0.3)
  Top 0.152: U2.3 15.05,21.4 15.61,21.4 16.02,20.99 19.22,20.99 21.6,18.6 21.85,18.6 21.98,18.73 22.42,18.73 22.73,18.42 22.73,17.98 22.4,17.65 v22.4,17.44 23.08,16.76 23.08,13.39 24.25,12.22 J5.3 | U1.21 25.85,21 24.9,20.05 24.9,19.63 v24.4,19.13
  Bottom 0.152: v22.4,17.44 24.09,19.13 v24.4,19.13
TMC_STEP
  Top 0.152: U2.6 15.35,22.95 16.4,21.9 19.6,21.9 21.08,20.42 24.38,20.42 24.85,20.88 U1.19
V+
  pour Top (rank 5, no thermals): -2.5,11.5 14.5,11.5 14.4,32.6 14.5,33 14.5,42.6 13.9,43 -2.5,43

### Text on the board
tPlace: V+ | GND | B1 | B2 | pwr | clk | err | A2 | A1 | atkstepper17 v0.1 | ATKP0
bPlace: days go sweeping past / the marathon eternal / sprint and then pass on